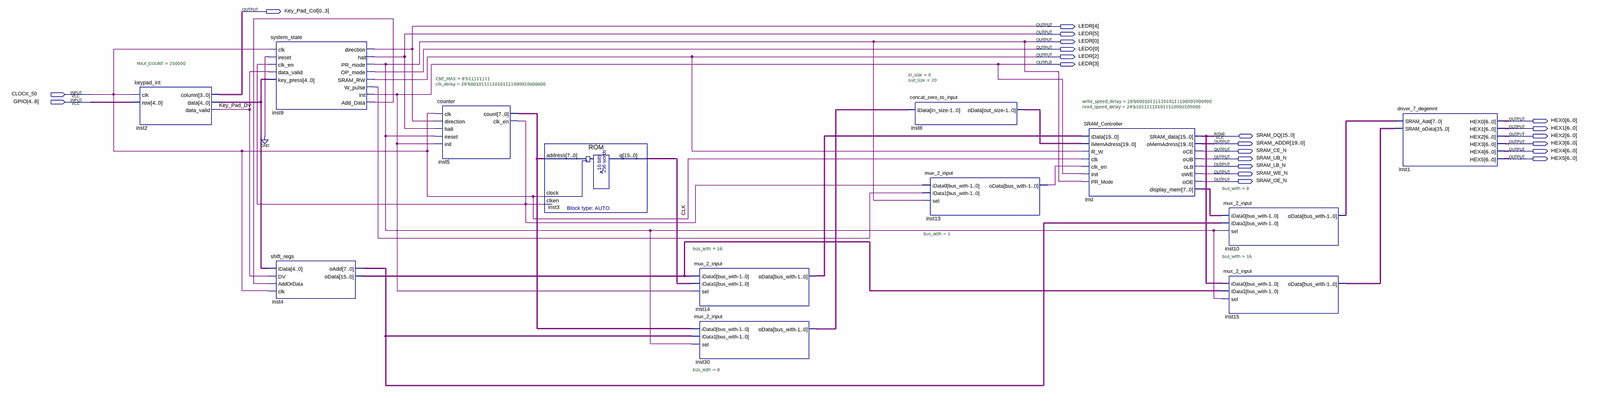
[diagram p0: schematic sheet, whole]
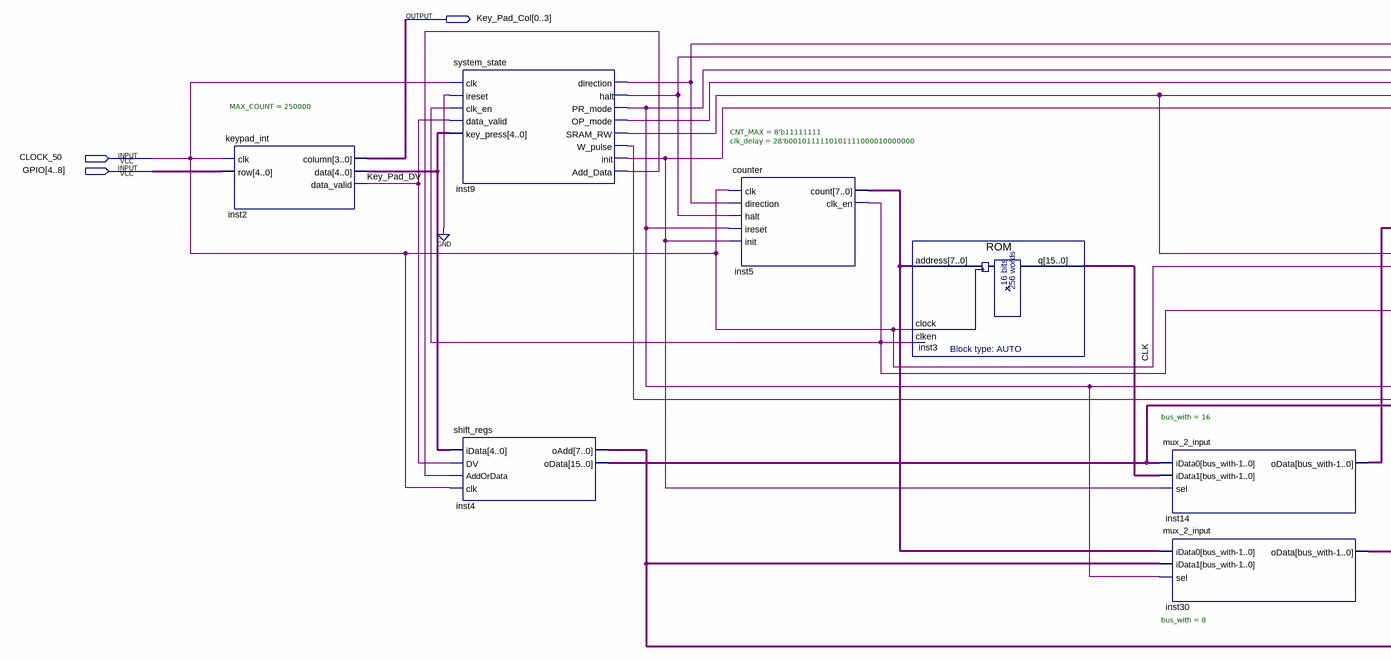
[diagram p1: schematic sheet, left part]
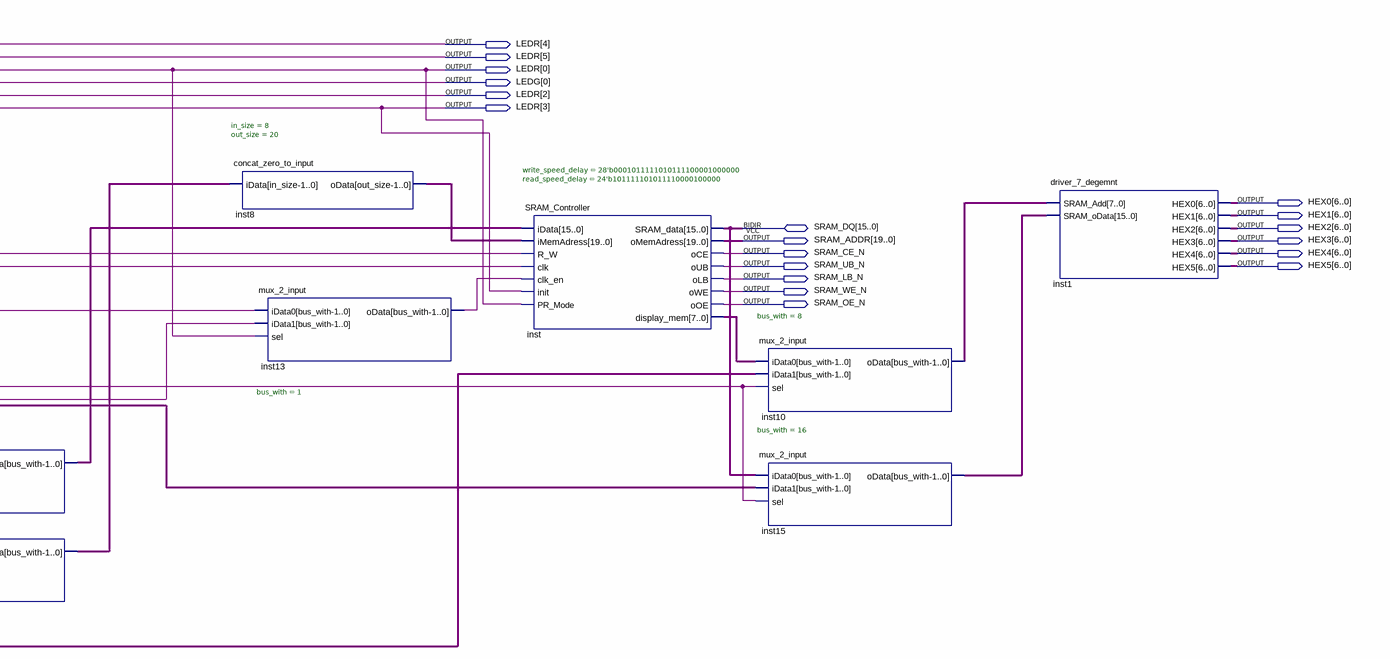
[diagram p2: schematic sheet, right part]
// Quartus schematic SRAM_Counter.bdf as structural Verilog: 13 symbols, 22 pins
module SRAM_Counter (
  input  CLOCK_50,
  input  [4:8] GPIO,
  inout  [15:0] SRAM_DQ,
  output [0:3] Key_Pad_Col,
  output [5:0] LEDR,
  output [0:0] LEDG,
  output [6:0] HEX0,
  output [6:0] HEX1,
  output [6:0] HEX2,
  output [19:0] SRAM_ADDR,
  output [6:0] HEX3,
  output SRAM_CE_N,
  output [6:0] HEX4,
  output SRAM_UB_N,
  output [6:0] HEX5,
  output SRAM_LB_N,
  output SRAM_WE_N,
  output SRAM_OE_N
);

  wire inst5_clk_en, inst9_add_data, inst9_w_pulse, inst13_odata, Key_Pad_DV;
  wire [4:0] inst2_data;
  wire [7:0] inst4_oadd, inst5_count, inst10_odata, inst30_odata, inst_display_mem;
  wire [15:0] inst3_q, inst4_odata, inst14_odata, inst15_odata;
  wire [19:0] inst8_odata;

  keypad_int #(.MAX_COUNT(250000)) inst2 (
    .clk(CLOCK_50), .row(GPIO), .column(Key_Pad_Col), .data(inst2_data), .data_valid(Key_Pad_DV));
  system_state inst9 (
    .clk(CLOCK_50), .ireset(1'b0), .clk_en(inst5_clk_en), .data_valid(Key_Pad_DV), .key_press(inst2_data),
    .direction(LEDR[4]), .halt(LEDR[5]), .PR_mode(LEDR[0]), .OP_mode(LEDG[0]), .SRAM_RW(LEDR[2]),
    .W_pulse(inst9_w_pulse), .init(LEDR[3]), .Add_Data(inst9_add_data));
  shift_regs inst4 (
    .iData(inst2_data), .DV(Key_Pad_DV), .AddOrData(inst9_add_data), .clk(CLOCK_50), .oAdd(inst4_oadd),
    .oData(inst4_odata));
  counter #(.CNT_MAX(8'b11111111), .clk_delay(28'b0010111110101111000010000000)) inst5 (
    .clk(CLOCK_50), .direction(LEDR[4]), .halt(LEDR[5]), .ireset(LEDR[0]), .init(LEDR[3]),
    .count(inst5_count), .clk_en(inst5_clk_en));
  ROM inst3 (.address(inst5_count), .clock(CLOCK_50), .clken(inst5_clk_en), .q(inst3_q));
  mux_2_input #(.bus_with(16)) inst14 (.iData0(inst4_odata), .iData1(inst3_q), .sel(LEDR[3]), .oData(inst14_odata));
  mux_2_input #(.bus_with(8)) inst30 (.iData0(inst5_count), .iData1(inst4_oadd), .sel(LEDR[0]), .oData(inst30_odata));
  concat_zero_to_input #(.in_size(8), .out_size(20)) inst8 (.iData(inst30_odata), .oData(inst8_odata));
  mux_2_input #(.bus_with(1)) inst13 (
    .iData0(inst5_clk_en), .iData1(inst9_w_pulse), .sel(LEDR[0]), .oData(inst13_odata));
  SRAM_Controller #(.write_speed_delay(28'b0001011111010111100001000000), .read_speed_delay(24'b101111101011110000100000)) inst (
    .iData(inst14_odata), .iMemAdress(inst8_odata), .R_W(LEDR[2]), .clk(CLOCK_50), .clk_en(inst13_odata),
    .init(LEDR[3]), .PR_Mode(LEDR[0]), .oMemAdress(SRAM_ADDR), .oCE(SRAM_CE_N), .oUB(SRAM_UB_N),
    .oLB(SRAM_LB_N), .oWE(SRAM_WE_N), .oOE(SRAM_OE_N), .display_mem(inst_display_mem), .SRAM_data(SRAM_DQ));
  mux_2_input #(.bus_with(8)) inst10 (
    .iData0(inst_display_mem), .iData1(inst4_oadd), .sel(LEDR[0]), .oData(inst10_odata));
  mux_2_input #(.bus_with(16)) inst15 (.iData0(SRAM_DQ), .iData1(inst4_odata), .sel(LEDR[0]), .oData(inst15_odata));
  driver_7_degemnt inst1 (
    .SRAM_Add(inst10_odata), .SRAM_oData(inst15_odata), .HEX0(HEX0), .HEX1(HEX1), .HEX2(HEX2), .HEX3(HEX3),
    .HEX4(HEX4), .HEX5(HEX5));

  // Other names for the same wires on the sheet: CLK = CLOCK_50; Direction = LEDR[4]; Halt = LEDR[5];
  //   OP_Mode = LEDR[2]; PR_Mode = LEDR[0]
endmodule
